# EAGLE schematic esp_coaster (EAGLE 9.0.1)
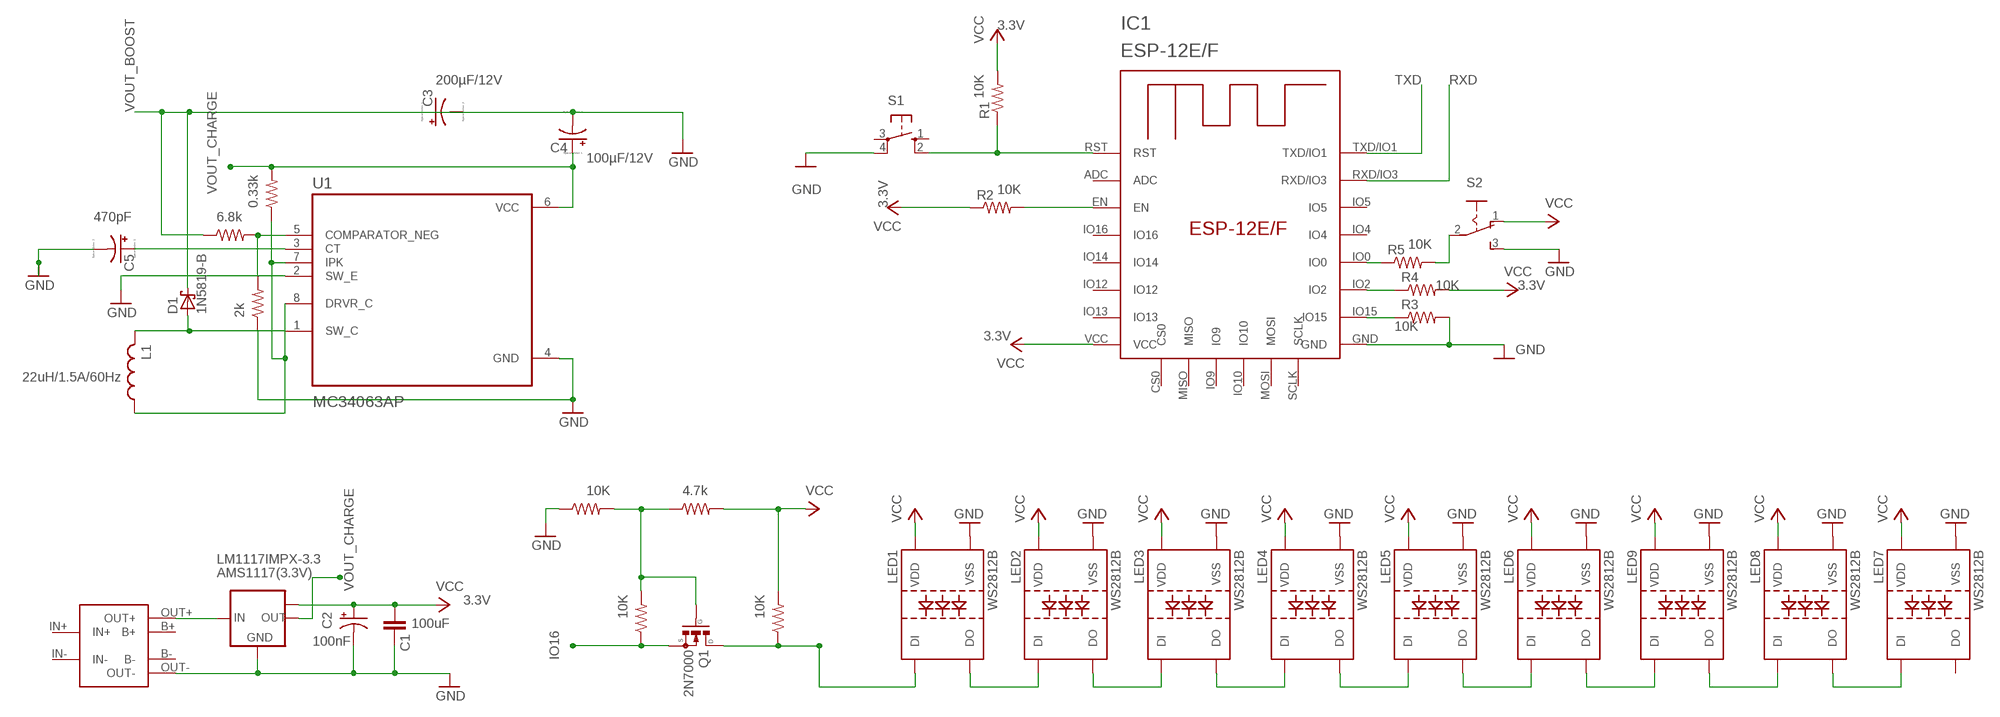
[diagram p0: schematic, sheet 1]

## Parts
AMS1117(3.3V)  LM1117IMPX-3.3  [SOT223]
C1  C-EUC1808  [C1808]
C2  CPOL-US139CLL-2R  [139CLL-2R]
C3  CPOL-US085CS-1AR  [085CS_1AR]
C4  CPOL-US085CS-1AR  [085CS_1AR]
C5  CPOL-US085CS-1AR  [085CS_1AR]
D1  1N5819-B  [DO41-7.6]
IC1  ESP-12E/F  [ESP-12E]
L1  L-US0204/5  [0204/5]
LED1  WS2812B  [WS2812B]
LED2  WS2812B  [WS2812B]
LED3  WS2812B  [WS2812B]
LED4  WS2812B  [WS2812B]
LED5  WS2812B  [WS2812B]
LED6  WS2812B  [WS2812B]
LED7  WS2812B  [WS2812B]
LED8  WS2812B  [WS2812B]
LED9  WS2812B  [WS2812B]
Q1  2N7000  [TO92]
R1  R-US_M2309  [M2309]
R2  R-US_M2309  [M2309]
R3  R-US_M2309  [M2309]
R4  R-US_M2309  [M2309]
R5  R-US_M2309  [M2309]
R6  R-US_M2309  [M2309]
R7  R-US_M2309  [M2309]
R8  R-US_M2309  [M2309]
R9  R-US_M2309  [M2309]
R10  R-US_M2309  [M2309]
R11  R-US_M2309  [M2309]
R12  R-US_M2309  [M2309]
S1  10-XX  [B3F-10XX]
S2  255SB  [255SB]
U1  MC34063AP  [DIP794W45P254L959H508Q8]
U$1  TP4056  [TP4056]

## Nets
GND: AMS1117(3.3V).1(GND) C1.1 C2.- C3.+ C4.- C5.- IC1.GND LED1.3(VSS) LED2.3(VSS) LED3.3(VSS) LED4.3(VSS) LED5.3(VSS) LED6.3(VSS) LED7.3(VSS) LED8.3(VSS) LED9.3(VSS) R3.2 R7.1 R11.1 S1.4(P1) S2.3(S) U1.2(SW_E) U1.4(GND) U$1.OUT-
IO16: Q1.1(S) R12.1
N$1: IC1.RST R1.1 S1.2(S1)
N$2: IC1.EN R2.2
N$3: IC1.IO15 R3.1
N$4: IC1.IO2 R4.1
N$5: IC1.IO0 R5.1
N$6: R5.2 S2.2(P)
N$7: AMS1117(3.3V).3(IN) U$1.OUT+
N$8: C5.+ U1.3(CT)
N$9: L1.1 R8.1 U1.7(IPK) U1.8(DRVR_C)
N$10: D1.A L1.2 U1.1(SW_C)
N$11: R6.2 R7.2 U1.5(COMPARATOR_NEG)
N$12: LED1.2(DO) LED2.4(DI)
N$13: LED1.4(DI) Q1.3(D) R9.1
N$14: Q1.2(G) R10.1 R11.2 R12.2
N$15: LED2.2(DO) LED3.4(DI)
N$16: LED3.2(DO) LED4.4(DI)
N$17: LED4.2(DO) LED5.4(DI)
N$18: LED5.2(DO) LED6.4(DI)
N$19: LED6.2(DO) LED9.4(DI)
N$20: LED8.4(DI) LED9.2(DO)
N$21: LED7.4(DI) LED8.2(DO)
RXD: IC1.RXD/IO3
TXD: IC1.TXD/IO1
VCC: AMS1117(3.3V).TAB(OUT1) C1.2 C2.+ IC1.VCC LED1.1(VDD) LED2.1(VDD) LED3.1(VDD) LED4.1(VDD) LED5.1(VDD) LED6.1(VDD) LED7.1(VDD) LED8.1(VDD) LED9.1(VDD) R1.2 R2.1 R4.2 R9.2 R10.2 S2.1(O)
VOUT_BOOST: C3.- D1.C R6.1
VOUT_CHARGE: AMS1117(3.3V).2(OUT) C4.+ R8.2 U1.6(VCC)
Unconnected: IC1.ADC IC1.CS0 IC1.IO4 IC1.IO5 IC1.IO9 IC1.IO10 IC1.IO12 IC1.IO13 IC1.IO14 IC1.IO16 IC1.MISO IC1.MOSI IC1.SCLK LED7.2(DO) S1.1(S) S1.3(P) U$1.B+ U$1.B- U$1.IN+ U$1.IN-

## Library data of the parts
AMS1117(3.3V) = lm1117:LM1117IMPX-*
C1 = rcl:C-EU: CAPACITOR, European symbol; SPICEPREFIX: C
C2 = rcl:CPOL-US: POLARIZED CAPACITOR, American symbol; SPICEPREFIX: C
C3 = resistor:CPOL-US: POLARIZED CAPACITOR, American symbol; C1: 200µF/12V
C4 = resistor:CPOL-US: POLARIZED CAPACITOR, American symbol; C2: 100µF/12V
C5 = resistor:CPOL-US: POLARIZED CAPACITOR, American symbol; CAPACITOR: 470pF
D1 = diode:1N581*: 1.0A SCHOTTKY BARRIER RECTIFIER Source: http://www.diodes.com/datasheets/ds23001.pdf
IC1 = esp-12e-f:ESP-12E/F
L1 = resistor:L-US: INDUCTOR, American symbol; INDUCTOR: 22uH/1.5A/60Hz
LED1-LED9 = WS2812:WS2812B
Q1 = 2N7000:2N7000: N-Channel Mosfet [S]-G-D pinout 2n7000: http://smallbear-electronics.mybigcommerce.com/transistor-fet-2n7000/ Check availability <https://pricing.snapeda.com/parts/2N7000/STMicroelectronics/view-part?ref=eda>; AVAILABILITY: In Stock; DESCRIPTION: N-Channel 60 V 350mA (Tc) 1W (Tc) Through Hole TO-92-3; MF: STMicroelectronics; MP: 2N7000; PACKAGE: TO-92 STMicroelectronics; PRICE: None; PURCHASE-URL: https://pricing.snapeda.com/search/part/2N7000/?ref=eda
R1-R12 = rcl:R-US_: RESISTOR, American symbol; SPICEPREFIX: R
S1 = switch-omron:10-XX: OMRON SWITCH; MPN: B3F-1000; OC_FARNELL: 176432; OC_NEWARK: 36M3542
S2 = switch:255SB: SLIDING SWITCH Distributor Buerklin, 11G810
U1 = MC34063AP:MC34063AP: Check availability <https://pricing.snapeda.com/parts/MC34063AP/Texas%20Instruments/view-part?ref=eda>; AVAILABILITY: In Stock; DESCRIPTION: 1.5-A boost, buck, inverting switching regulator, operation from 0°C to 70°C; MF: Texas Instruments; MP: MC34063AP; PACKAGE: PDIP-8 Texas; PRICE: None; PURCHASE-URL: https://pricing.snapeda.com/search/part/MC34063AP/?ref=eda
U$1 = 32teeth - TP4056 Module:TP4056